# Altium schematic sheet PAGE18.SchDoc
size 246 x 182 mm
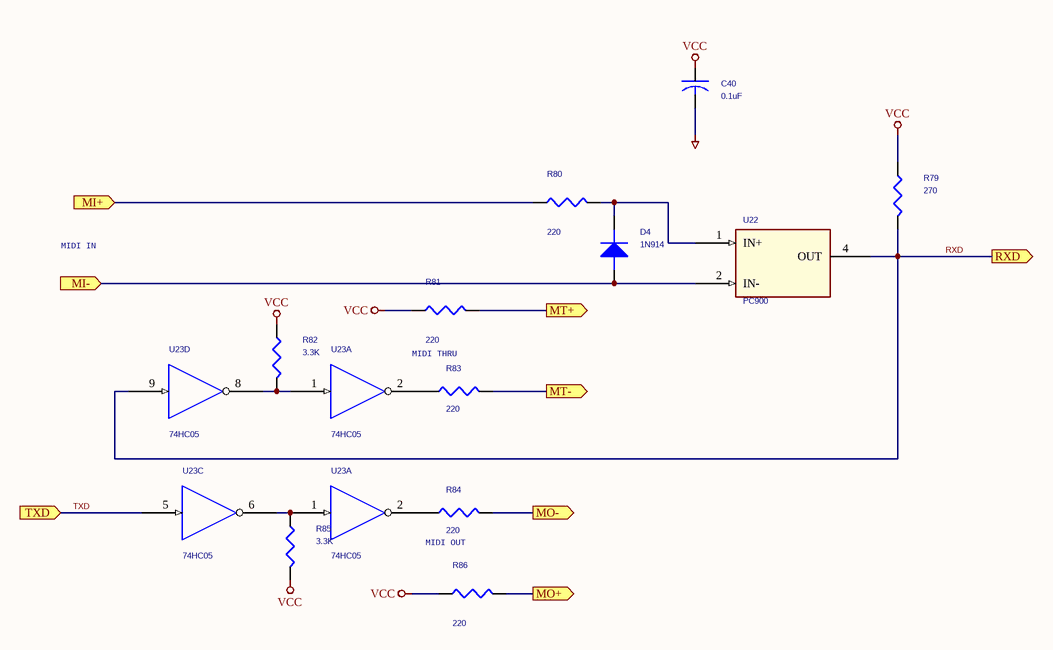
[diagram p0: PAGE18.SchDoc]

## Parts
(Parts that share a designator on the sheet are numbered #1, #2 ... from top to bottom, then left to right.)
C40  0.1uF  [AXIALCAP0.3]
D4  1N914  [DIODE0.4]
R79  270  [AXIAL0.4]
R80  220  [AXIAL0.4]
R81  220  [AXIAL0.4]
R82  3.3K  [AXIAL0.4]
R83  220  [AXIAL0.4]
R84  220  [AXIAL0.4]
R85  3.3K  [AXIAL0.4]
R86  220  [AXIAL0.4]
U22  PC900  [DIP6]
U23#1  74HC05  [DIP14]  (parts A,C,D of 6)
U23#2  74HC05  [DIP14]  (part A of 6)

## Ports
MI+ (in), MI- (in), MO+ (out), MO- (out), MT+ (out), MT- (out), RXD (out), TXD (in)

## Nets
DGND: C40.2
GND: U22.5(GND) U23#1.7(GND) U23#2.7(GND)
VCC: C40.1 R79.1 R81.2 R82.1 R85.2 R86.2 U22.6(VCC) U23#1.14(VCC) U23#2.14(VCC)
MI+: R80.1 ; port MI+
MI-: D4.ANODE U22.2(IN-) ; port MI-
MO+: R86.1 ; port MO+
MO-: R84.2 ; port MO-
MT+: R81.1 ; port MT+
MT-: R83.2 ; port MT-
RXD: R79.2 U22.4(OUT) U23#1.9(I) ; port RXD
TXD: U23#1.5(I) ; port TXD
NetD4_CATHODE: D4.CATHODE R80.2 U22.1(IN+)
NetR82_2: R82.2 U23#1.1(I) U23#1.8(O)
NetR83_1: R83.1 U23#1.2(O)
NetR84_1: R84.1 U23#2.2(O)
NetR85_1: R85.1 U23#1.6(O) U23#2.1(I)

## Notes on the sheet
- MIDI IN
- MIDI THRU
- MIDI OUT

## Library data of the parts
C40 = CAP_Dup1
D4 = DIODE_Dup1
R79-R81 R83 R84 R86 = R
R82 R85 = R_Dup1